# Altium schematic sheet OK1050-C_V1.2_Connect.SchDoc
size A3; Revision: 1.2; SheetNumber: 4; SheetTotal: 7; PageSetup: Record=PageOptions|CenterHorizontal=True|CenterVertical=True|PrintScale=1.04|XCorrection=1.00|YCorrection=1.00|PrintKind=0|BorderSize=5000000|LeftOffset=0|BottomOffset=0|Orientation=2|PaperLength=1000|PaperWidth=1000|Scale=100|PaperSource=7|PrintQuality=-3|MediaType=1|DitherType=10|PrintScaleMode=1|PaperKind=A3|PaperIndex=8
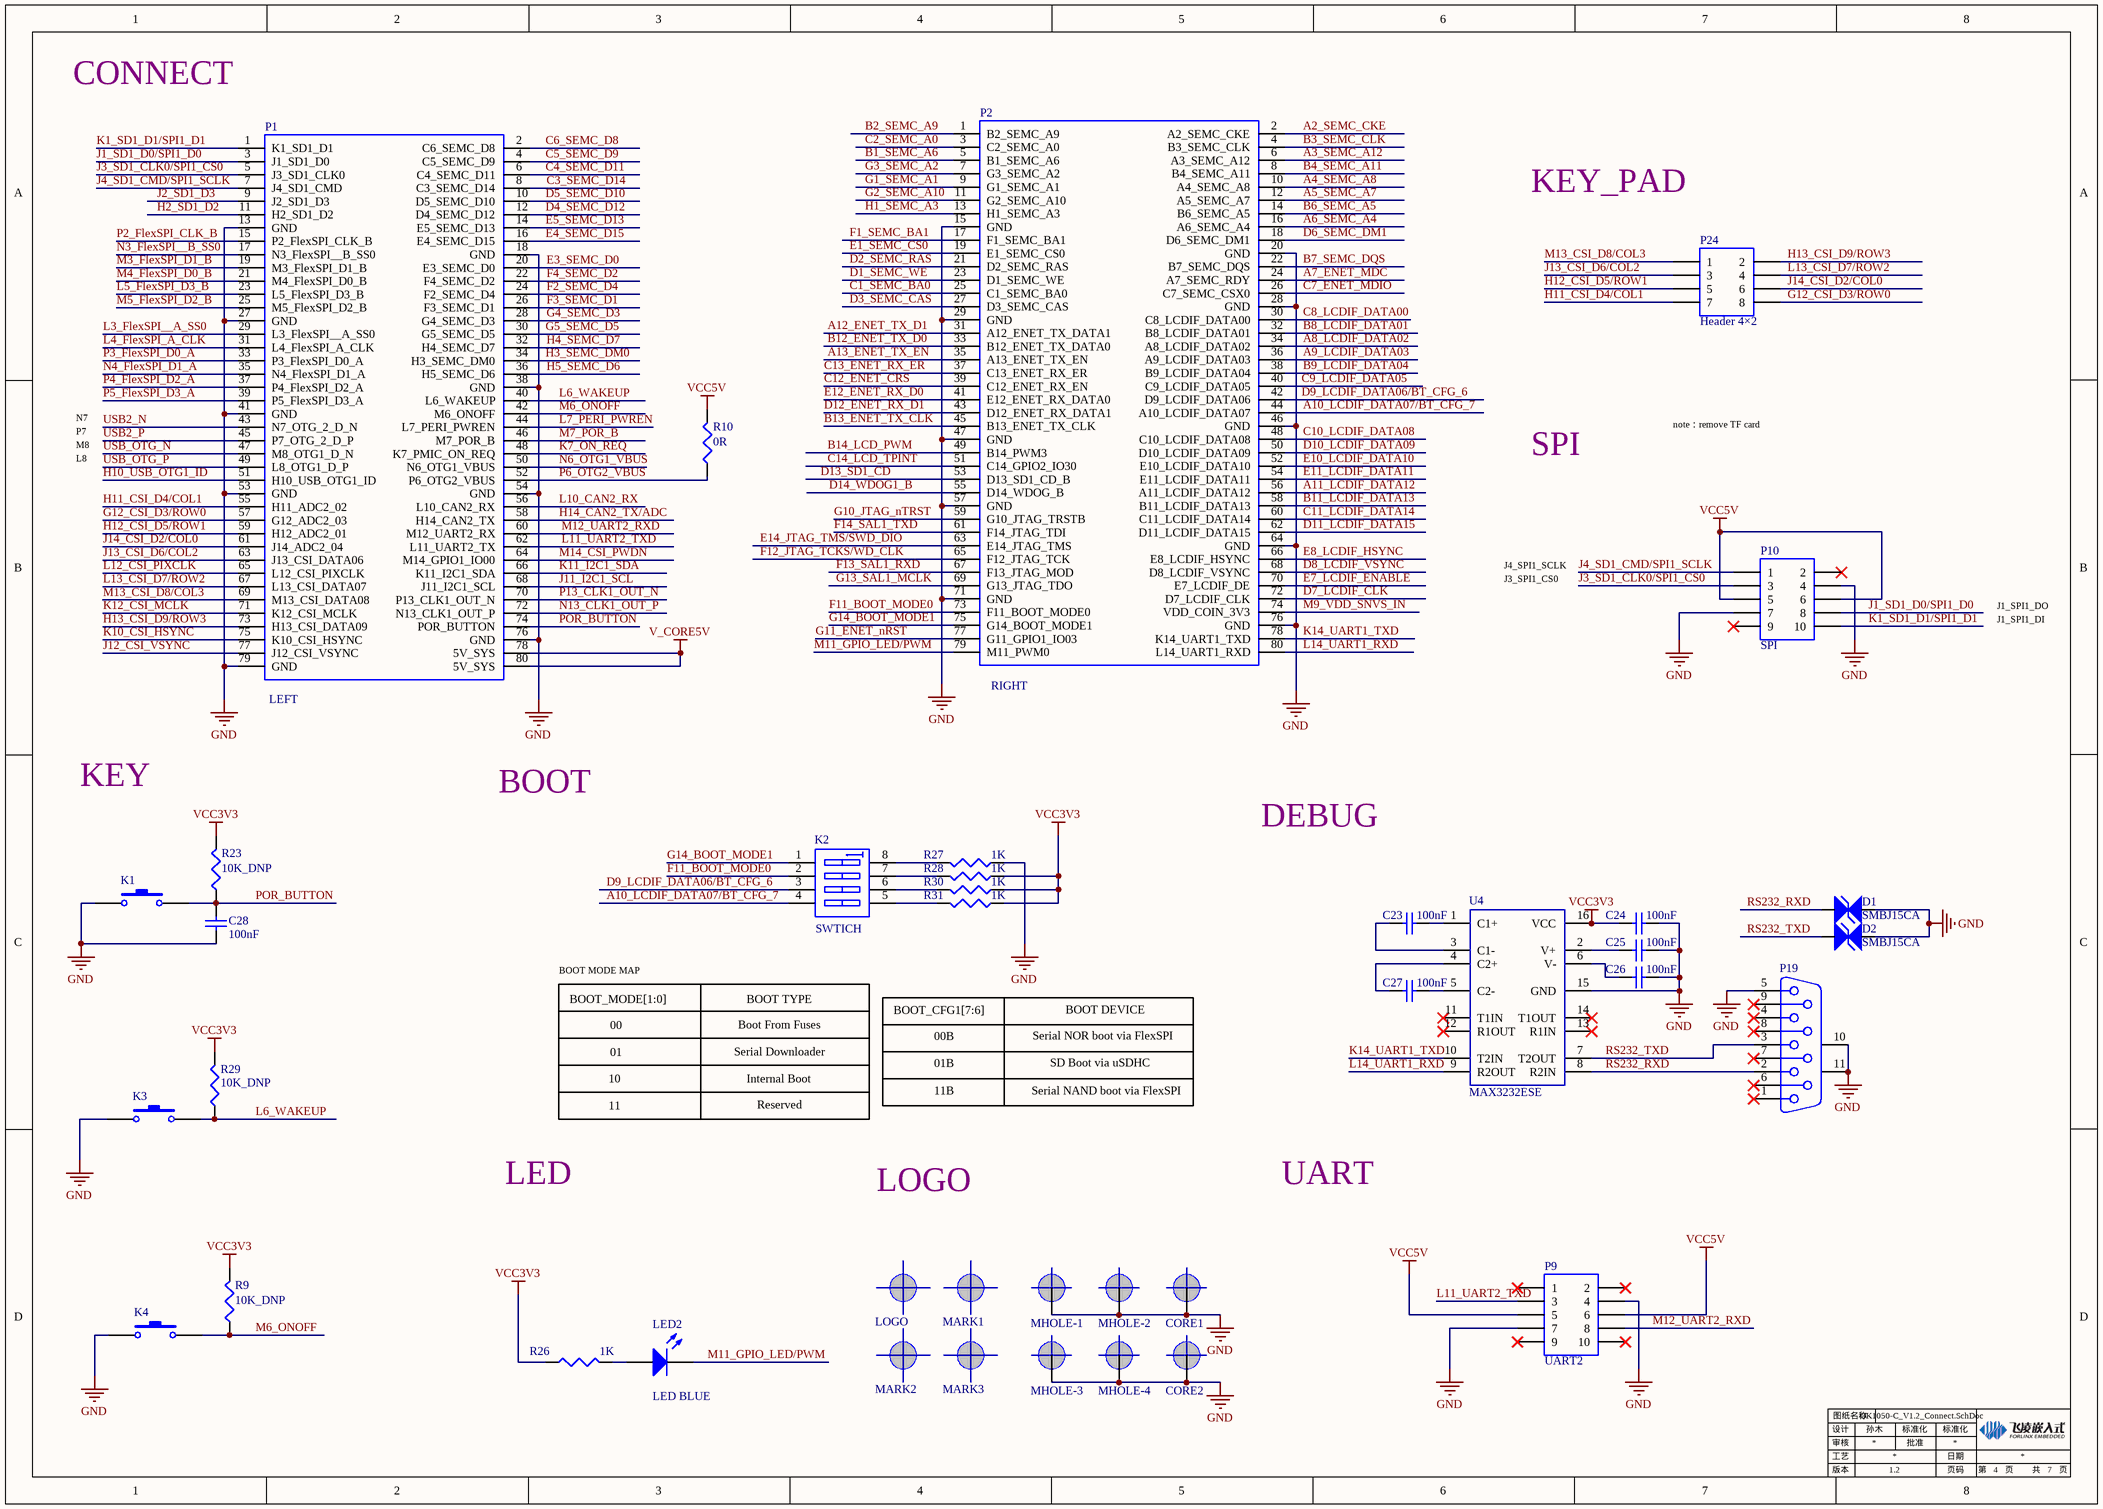
[diagram p0: OK1050-C_V1.2_Connect.SchDoc]

## Parts
C23  100nF  [0603C+]
C24  100nF  [0603C+]
C25  100nF  [0603C+]
C26  100nF  [0603C+]
C27  100nF  [0603C+]
C28  100nF  [0603C+]
D1  SMBJ15CA  [SMB/DO-214AA]
D2  SMBJ15CA  [SMB/DO-214AA]
K1  6*6*5侧位带支架  [SW-01]  (value not drawn)
K2  SWTICH  [SMD_4]
K3  6*6*5侧位2脚带支架  [SW-01]  (value not drawn)
K4  6*6*5侧位2脚带支架  [SW-01]  (value not drawn)
LED2  BOOK: LED BLUE  [LED0603_M1608]  (hidden comment: LED_BULE)
LOGO1  LOGO  [LOGO]
M1  MHOLE-1  [3.2mm_hole]
M2  MHOLE-2  [3.2mm_hole]
M3  MHOLE-3  [3.2mm_hole]
M4  MHOLE-4  [3.2mm_hole]
M5  CORE1  [2.1mm_hole]
M6  CORE2  [2.1mm_hole]
Mark1  MARK1  [MARK POINT]
Mark2  MARK2  [MARK POINT]
Mark3  MARK3  [MARK POINT]
P1  LEFT  [CON80]
P2  RIGHT  [CON80]
P9  UART2  [IDC10S]
P10  SPI  [IDC10S]
P19  DEBUG  [DSUB1.385-2H9-M]  (value not drawn)
P24  Header 4×2  [HDR2X4]
R9  10K_DNP  [0603R+]
R10  0R  [0603R+]
R23  10K_DNP  [0603R+]
R26  1K  [0603R+]
R27  1K  [0603R+]
R28  1K  [0603R+]
R29  10K_DNP  [0603R+]
R30  1K  [0603R+]
R31  1K  [0603R+]
U4  MAX3232ESE  [SOIC-16N]

## Nets
GND: C24.1 C25.1 C26.1 C28.1 D1.2 D2.2 K1.1 K3.1 K4.1 M1.1(EF) M2.1(EF) M3.1(EF) M4.1(EF) M5.1(EF) M6.1(EF) P1.13(GND) P1.18(GND) P1.27(GND) P1.38(GND) P1.41(GND) P1.53(GND) P1.54(GND) P1.76(GND) P1.79(GND) P2.15(GND) P2.20(GND) P2.28(GND) P2.29(GND) P2.46(GND) P2.47(GND) P2.57(GND) P2.64(GND) P2.71(GND) P2.76(GND) P9.4 P9.7 P10.4 P10.7 P19.5 P19.10(MH1) P19.11(MH2) R27.1 U4.15(GND)
V_CORE5V: P1.78(5V_SYS) P1.80(5V_SYS)
VCC3V3: C24.2 R9.2 R23.2 R26.1 R28.1 R29.2 R30.1 R31.1 U4.16(VCC)
VCC5V: P9.5 P9.6 P10.5 P10.6 R10.2
A2_SEMC_CKE: P2.2(A2_SEMC_CKE)
A3_SEMC_A12: P2.6(A3_SEMC_A12)
A4_SEMC_A8: P2.10(A4_SEMC_A8)
A5_SEMC_A7: P2.12(A5_SEMC_A7)
A6_SEMC_A4: P2.16(A6_SEMC_A4)
A7_ENET_MDC: P2.24(A7_SEMC_RDY)
A8_LCDIF_DATA02: P2.34(A8_LCDIF_DATA02)
A9_LCDIF_DATA03: P2.36(A9_LCDIF_DATA03)
A10_LCDIF_DATA07/BT_CFG_7: K2.4(A4) P2.44(A10_LCDIF_DATA07)
A11_LCDIF_DATA12: P2.56(A11_LCDIF_DATA12)
A12_ENET_TX_D1: P2.31(A12_ENET_TX_DATA1)
A13_ENET_TX_EN: P2.35(A13_ENET_TX_EN)
B1_SEMC_A6: P2.5(B1_SEMC_A6)
B2_SEMC_A9: P2.1(B2_SEMC_A9)
B3_SEMC_CLK: P2.4(B3_SEMC_CLK)
B4_SEMC_A11: P2.8(B4_SEMC_A11)
B6_SEMC_A5: P2.14(B6_SEMC_A5)
B7_SEMC_DQS: P2.22(B7_SEMC_DQS)
B8_LCDIF_DATA01: P2.32(B8_LCDIF_DATA01)
B9_LCDIF_DATA04: P2.38(B9_LCDIF_DATA04)
B11_LCDIF_DATA13: P2.58(B11_LCDIF_DATA13)
B12_ENET_TX_D0: P2.33(B12_ENET_TX_DATA0)
B13_ENET_TX_CLK: P2.45(B13_ENET_TX_CLK)
B14_LCD_PWM: P2.49(B14_PWM3)
C1_SEMC_BA0: P2.25(C1_SEMC_BA0)
C2_SEMC_A0: P2.3(C2_SEMC_A0)
C3_SEMC_D14: P1.8(C3_SEMC_D14)
C4_SEMC_D11: P1.6(C4_SEMC_D11)
C5_SEMC_D9: P1.4(C5_SEMC_D9)
C6_SEMC_D8: P1.2(C6_SEMC_D8)
C7_ENET_MDIO: P2.26(C7_SEMC_CSX0)
C8_LCDIF_DATA00: P2.30(C8_LCDIF_DATA00)
C9_LCDIF_DATA05: P2.40(C9_LCDIF_DATA05)
C10_LCDIF_DATA08: P2.48(C10_LCDIF_DATA08)
C11_LCDIF_DATA14: P2.60(C11_LCDIF_DATA14)
C12_ENET_CRS: P2.39(C12_ENET_RX_EN)
C13_ENET_RX_ER: P2.37(C13_ENET_RX_ER)
C14_LCD_TPINT: P2.51(C14_GPIO2_IO30)
D1_SEMC_WE: P2.23(D1_SEMC_WE)
D2_SEMC_RAS: P2.21(D2_SEMC_RAS)
D3_SEMC_CAS: P2.27(D3_SEMC_CAS)
D4_SEMC_D12: P1.12(D4_SEMC_D12)
D5_SEMC_D10: P1.10(D5_SEMC_D10)
D6_SEMC_DM1: P2.18(D6_SEMC_DM1)
D7_LCDIF_CLK: P2.72(D7_LCDIF_CLK)
D8_LCDIF_VSYNC: P2.68(D8_LCDIF_VSYNC)
D9_LCDIF_DATA06/BT_CFG_6: K2.3(A3) P2.42(D9_LCDIF_DATA06)
D10_LCDIF_DATA09: P2.50(D10_LCDIF_DATA09)
D11_LCDIF_DATA15: P2.62(D11_LCDIF_DATA15)
D12_ENET_RX_D1: P2.43(D12_ENET_RX_DATA1)
D13_SD1_CD: P2.53(D13_SD1_CD_B)
D14_WDOG1_B: P2.55(D14_WDOG_B)
E1_SEMC_CS0: P2.19(E1_SEMC_CS0)
E3_SEMC_D0: P1.20(E3_SEMC_D0)
E4_SEMC_D15: P1.16(E4_SEMC_D15)
E5_SEMC_D13: P1.14(E5_SEMC_D13)
E7_LCDIF_ENABLE: P2.70(E7_LCDIF_DE)
E8_LCDIF_HSYNC: P2.66(E8_LCDIF_HSYNC)
E10_LCDIF_DATA10: P2.52(E10_LCDIF_DATA10)
E11_LCDIF_DATA11: P2.54(E11_LCDIF_DATA11)
E12_ENET_RX_D0: P2.41(E12_ENET_RX_DATA0)
E14_JTAG_TMS/SWD_DIO: P2.63(E14_JTAG_TMS)
F1_SEMC_BA1: P2.17(F1_SEMC_BA1)
F2_SEMC_D4: P1.24(F2_SEMC_D4)
F3_SEMC_D1: P1.26(F3_SEMC_D1)
F4_SEMC_D2: P1.22(F4_SEMC_D2)
F11_BOOT_MODE0: K2.2(A2) P2.73(F11_BOOT_MODE0)
F12_JTAG_TCKS/WD_CLK: P2.65(F12_JTAG_TCK)
F13_SAL1_RXD: P2.67(F13_JTAG_MOD)
F14_SAL1_TXD: P2.61(F14_JTAG_TDI)
G1_SEMC_A1: P2.9(G1_SEMC_A1)
G2_SEMC_A10: P2.11(G2_SEMC_A10)
G3_SEMC_A2: P2.7(G3_SEMC_A2)
G4_SEMC_D3: P1.28(G4_SEMC_D3)
G5_SEMC_D5: P1.30(G5_SEMC_D5)
G10_JTAG_nTRST: P2.59(G10_JTAG_TRSTB)
G11_ENET_nRST: P2.77(G11_GPIO1_IO03)
G12_CSI_D3/ROW0: P1.57(G12_ADC2_03) P24.8
G13_SAL1_MCLK: P2.69(G13_JTAG_TDO)
G14_BOOT_MODE1: K2.1(A1) P2.75(G14_BOOT_MODE1)
H1_SEMC_A3: P2.13(H1_SEMC_A3)
H2_SD1_D2: P1.11(H2_SD1_D2)
H3_SEMC_DM0: P1.34(H3_SEMC_DM0)
H4_SEMC_D7: P1.32(H4_SEMC_D7)
H5_SEMC_D6: P1.36(H5_SEMC_D6)
H10_USB_OTG1_ID: P1.51(H10_USB_OTG1_ID)
H11_CSI_D4/COL1: P1.55(H11_ADC2_02) P24.7
H12_CSI_D5/ROW1: P1.59(H12_ADC2_01) P24.5
H13_CSI_D9/ROW3: P1.73(H13_CSI_DATA09) P24.2
H14_CAN2_TX/ADC: P1.58(H14_CAN2_TX)
J1_SD1_D0/SPI1_D0: P1.3(J1_SD1_D0) P10.8
J2_SD1_D3: P1.9(J2_SD1_D3)
J3_SD1_CLK0/SPI1_CS0: P1.5(J3_SD1_CLK0) P10.3
J4_SD1_CMD/SPI1_SCLK: P1.7(J4_SD1_CMD) P10.1
J11_I2C1_SCL: P1.68(J11_I2C1_SCL)
J12_CSI_VSYNC: P1.77(J12_CSI_VSYNC)
J13_CSI_D6/COL2: P1.63(J13_CSI_DATA06) P24.3
J14_CSI_D2/COL0: P1.61(J14_ADC2_04) P24.6
K1_SD1_D1/SPI1_D1: P1.1(K1_SD1_D1) P10.10
K7_ON_REQ: P1.48(K7_PMIC_ON_REQ)
K10_CSI_HSYNC: P1.75(K10_CSI_HSYNC)
K11_I2C1_SDA: P1.66(K11_I2C1_SDA)
K12_CSI_MCLK: P1.71(K12_CSI_MCLK)
K14_UART1_TXD: P2.78(K14_UART1_TXD) U4.10(T2IN)
L3_FlexSPI__A_SS0: P1.29(L3_FlexSPI__A_SS0)
L4_FlexSPI_A_CLK: P1.31(L4_FlexSPI_A_CLK)
L5_FlexSPI_D3_B: P1.23(L5_FlexSPI_D3_B)
L6_WAKEUP: K3.2 P1.40(L6_WAKEUP) R29.1
L7_PERI_PWREN: P1.44(L7_PERI_PWREN)
L10_CAN2_RX: P1.56(L10_CAN2_RX)
L11_UART2_TXD: P1.62(L11_UART2_TX) P9.3
L12_CSI_PIXCLK: P1.65(L12_CSI_PIXCLK)
L13_CSI_D7/ROW2: P1.67(L13_CSI_DATA07) P24.4
L14_UART1_RXD: P2.80(L14_UART1_RXD) U4.9(R2OUT)
M3_FlexSPI_D1_B: P1.19(M3_FlexSPI_D1_B)
M4_FlexSPI_D0_B: P1.21(M4_FlexSPI_D0_B)
M5_FlexSPI_D2_B: P1.25(M5_FlexSPI_D2_B)
M6_ONOFF: K4.2 P1.42(M6_ONOFF) R9.1
M7_POR_B: P1.46(M7_POR_B)
M9_VDD_SNVS_IN: P2.74(VDD_COIN_3V3)
M11_GPIO_LED/PWM: LED2.2(K) P2.79(M11_PWM0)
M12_UART2_RXD: P1.60(M12_UART2_RX) P9.8
M13_CSI_D8/COL3: P1.69(M13_CSI_DATA08) P24.1
M14_CSI_PWDN: P1.64(M14_GPIO1_IO00)
N3_FlexSPI__B_SS0: P1.17(N3_FlexSPI__B_SS0)
N4_FlexSPI_D1_A: P1.35(N4_FlexSPI_D1_A)
N6_OTG1_VBUS: P1.50(N6_OTG1_VBUS)
N13_CLK1_OUT_P: P1.72(N13_CLK1_OUT_P)
P2_FlexSPI_CLK_B: P1.15(P2_FlexSPI_CLK_B)
P3_FlexSPI_D0_A: P1.33(P3_FlexSPI_D0_A)
P4_FlexSPI_D2_A: P1.37(P4_FlexSPI_D2_A)
P5_FlexSPI_D3_A: P1.39(P5_FlexSPI_D3_A)
P6_OTG2_VBUS: P1.52(P6_OTG2_VBUS) R10.1
P13_CLK1_OUT_N: P1.70(P13_CLK1_OUT_N)
POR_BUTTON: C28.2 K1.2 P1.74(POR_BUTTON) R23.1
RS232_RXD: D1.1 P19.2 U4.8(R2IN)
RS232_TXD: D2.1 P19.3 U4.7(T2OUT)
USB2_N: P1.43(N7_OTG_2_D_N)
USB2_P: P1.45(P7_OTG_2_D_P)
USB_OTG_N: P1.47(M8_OTG1_D_N)
USB_OTG_P: P1.49(L8_OTG1_D_P)
NetC23_1: C23.1 U4.1(C1+)
NetC23_2: C23.2 U4.3(C1-)
NetC25_2: C25.2 U4.2(V+)
NetC26_2: C26.2 U4.6(V-)
NetC27_1: C27.1 U4.5(C2-)
NetC27_2: C27.2 U4.4(C2+)
NetK2_5: K2.5(B4) R31.2
NetK2_6: K2.6(B3) R30.2
NetK2_7: K2.7(B2) R28.2
NetK2_8: K2.8(B1) R27.2
NetLED2_1: LED2.1(A) R26.2

Not connected (* = marked no-connect by the designer): P9 1* 2* 9* 10*; P10 2* 9*; P19 1* 4* 6* 7* 8* 9*; U4 11(T1IN)* 12(R1OUT)* 13(R1IN)* 14(T1OUT)*

## Notes on the sheet
- CONNECT
- KEY_PAD
- N7
- P7
- M8
- note：remove TF card
- L8
- SPI
- J4_SPI1_SCLK
- J3_SPI1_CS0
- J1_SPI1_DO
- J1_SPI1_DI
- KEY
- BOOT
- DEBUG
- BOOT MODE MAP
- BOOT_MODE[1:0]
- 00
- 01
- Serial Downloader
- Boot From Fuses
- BOOT TYPE
- BOOT_CFG1[7:6]
- 00B
- Serial NOR boot via FlexSPI
- BOOT DEVICE
- 10
- 11
- Internal Boot
- Reserved
- 01B
- 11B
- Serial NAND boot via FlexSPI
- SD Boot via uSDHC
- LED
- UART
- LOGO
- 设计
- 审核
- 工艺
- 图纸名称
- 孙木
- 批准
- 标准化
- 日期
- 版本
- 页码
- 第
- 页
- 共

## Library data of the parts
C23-C28 = Cap: Capacitor; Published: 8-Jun-2000; LatestRevisionDate: 17-Jul-2002; LatestRevisionNote: Re-released for DXP Platform.; PackageReference: RAD-0.3; Publisher: Altium Limited; PackageDescription: Radial Cap, Thru-Hole; 2 Leads; 0.3 in Pin Spacing; Value: 100nF
D1 D2 = TVS: Value: SMBJ15CA
K1 K3 K4 = SW-PB: Switch; Published: 24-Mar-1999; LatestRevisionDate: 17-Jul-2002; LatestRevisionNote: Re-released for DXP Platform.; PackageReference: SPST-2; Publisher: Altium Limited
K2 = SWTICH_DIP6
LED2 = LED2: Typical RED, GREEN, YELLOW, AMBER GaAs LED; Published: 8-Jun-2000; LatestRevisionDate: 17-Jul-2002; LatestRevisionNote: Re-released for DXP Platform.; PackageDocument: Feb-2002; PackageReference: 3.2X1.6X1.1; Publisher: Altium Limited
LOGO1 = MHOLE_1
M1 M3 M4 M6 = MHOLE-2_1
M5 = MHOLE-2
Mark1-Mark3 = MHOLE
P1 = Header40X2_left: Header, 30-Pin, Dual row; LatestRevisionDate: 17-Jul-2002; LatestRevisionNote: Re-released for DXP Platform.; Publisher: Altium Limited
P2 = Header40X2_right: Header, 30-Pin, Dual row; LatestRevisionDate: 17-Jul-2002; LatestRevisionNote: Re-released for DXP Platform.; Publisher: Altium Limited
P9 P10 = Header 5X2: Header, 5-Pin, Dual row; LatestRevisionDate: 17-Jul-2002; LatestRevisionNote: Re-released for DXP Platform.; Publisher: Altium Limited
P19 = D Connector 9: Receptacle Assembly, 9 Position, Right Angle; PackageDocument: O; Positions: 9; Published: 15-Jun-2001; LatestRevisionDate: 17-Jul-2002; LatestRevisionNote: Re-released for DXP Platform.; DatasheetDocument: 1-Sep-1999; PackageReference: 788750; Publisher: Altium Limited; Orientation: Right Angle; Gender: Receptacle
R9 R10 R23 R26-R31 = Res3: Resistor; Published: 8-Jun-2000; LatestRevisionDate: 29-May-2009; LatestRevisionNote: IPC-7351 Footprint Added.; PackageReference: J1-0603; Publisher: Altium Limited; PackageDescription: Chip Resistor
  R9 R23 R29: Value: 10K_DNP
  R10: Value: 0R
  R26-R28 R30 R31: Value: 1K
U4 = MAX3232